# Altium schematic sheet MiniPCIe.SchDoc: POLYSOME CRYPTO 01
size A4; Revision: V1; SheetNumber: 7; SheetTotal: 8; ProjectName: POLYSOME CRYPTO 01
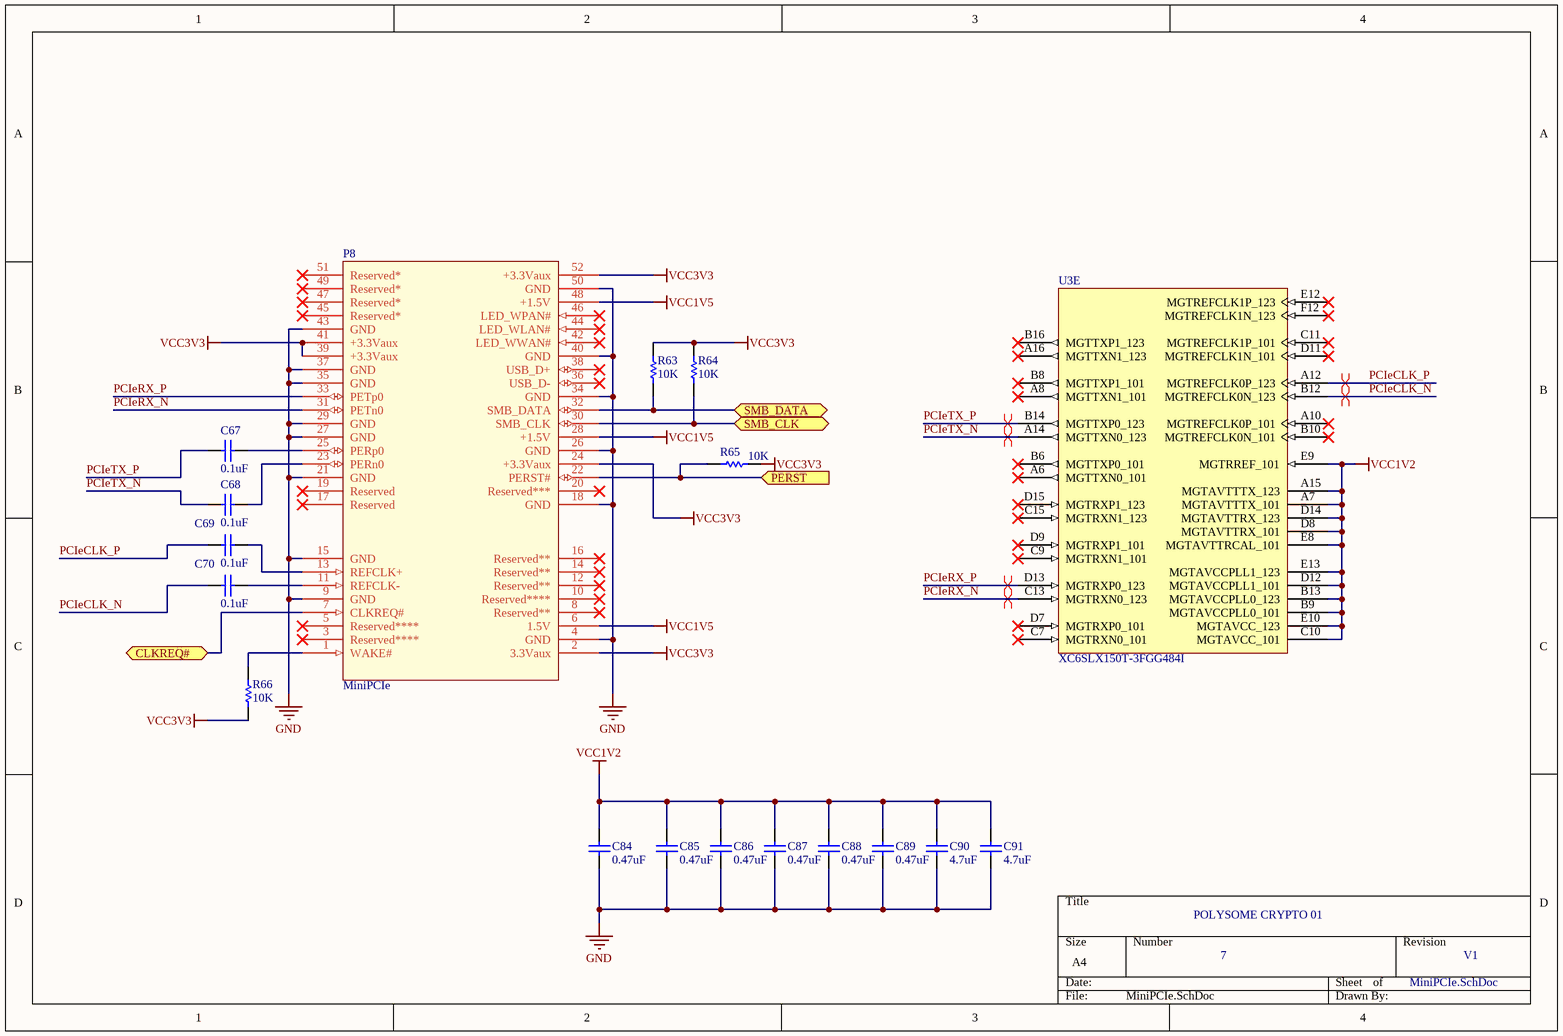
[diagram p0: MiniPCIe.SchDoc]

## Parts
C67  value 0.1uF  [0402]  (hidden comment: Cap Semi)
C68  value 0.1uF  [0402]  (hidden comment: Cap Semi)
C69  value 0.1uF  [0402]  (hidden comment: Cap Semi)
C70  value 0.1uF  [0402]  (hidden comment: Cap Semi)
C84  value 0.47uF  [0402]  (hidden comment: Cap Semi)
C85  value 0.47uF  [0402]  (hidden comment: Cap Semi)
C86  value 0.47uF  [0402]  (hidden comment: Cap Semi)
C87  value 0.47uF  [0402]  (hidden comment: Cap Semi)
C88  value 0.47uF  [0402]  (hidden comment: Cap Semi)
C89  value 0.47uF  [0402]  (hidden comment: Cap Semi)
C90  value 4.7uF  [0402]  (hidden comment: Cap Semi)
C91  value 4.7uF  [0402]  (hidden comment: Cap Semi)
P8  MiniPCIe  [Mini PCI Express]
R63  value 10K  [0402]  (hidden comment: Res Semi)
R64  value 10K  [0402]  (hidden comment: Res Semi)
R65  value 10K  [0402]  (hidden comment: Res Semi)
R66  value 10K  [0402]  (hidden comment: Res Semi)
U3  XC6SLX150T-3FGG484I  [FGG484]  (part E of 8)

## Ports
CLKREQ#, PERST (in), SMB_CLK (bidir), SMB_DATA (bidir)

## Nets
GND: C84.2 C85.2 C86.2 C87.2 C88.2 C89.2 C90.2 C91.2 P8.4(GND) P8.9(GND) P8.15(GND) P8.18(GND) P8.21(GND) P8.26(GND) P8.27(GND) P8.29(GND) P8.34(GND) P8.35(GND) P8.37(GND) P8.40(GND) P8.43(GND) P8.50(GND)
VCC1V2: C84.1 C85.1 C86.1 C87.1 C88.1 C89.1 C90.1 C91.1 U3.A7(MGTAVTTTX_101) U3.A15(MGTAVTTTX_123) U3.B9(MGTAVCCPLL0_101) U3.B13(MGTAVCCPLL0_123) U3.C10(MGTAVCC_101) U3.D8(MGTAVTTRX_101) U3.D12(MGTAVCCPLL1_101) U3.D14(MGTAVTTRX_123) U3.E8(MGTAVTTRCAL_101) U3.E9(MGTRREF_101) U3.E10(MGTAVCC_123) U3.E13(MGTAVCCPLL1_123)
VCC1V5: P8.6(1.5V) P8.28(+1.5V) P8.48(+1.5V)
VCC3V3: P8.2(3.3Vaux) P8.24(+3.3Vaux) P8.39(+3.3Vaux) P8.41(+3.3Vaux) P8.52(+3.3Vaux) R63.2 R64.2 R65.2 R66.1
CLKREQ#: P8.7(CLKREQ#) ; port CLKREQ#
PCIeCLK_N: C70.2 U3.B12(MGTREFCLK0N_123)
PCIeCLK_P: C69.2 U3.A12(MGTREFCLK0P_123)
PCIeRX_N: P8.31(PETn0) U3.C13(MGTRXN0_123)
PCIeRX_P: P8.33(PETp0) U3.D13(MGTRXP0_123)
PCIeTX_N: C68.2 U3.A14(MGTTXN0_123)
PCIeTX_P: C67.2 U3.B14(MGTTXP0_123)
PERST: P8.22(PERST#) R65.1 ; port PERST
SMB_CLK: P8.30(SMB_CLK) R64.1 ; port SMB_CLK
SMB_DATA: P8.32(SMB_DATA) R63.1 ; port SMB_DATA
NetC67_1: C67.1 P8.25(PERp0)
NetC68_1: C68.1 P8.23(PERn0)
NetC69_1: C69.1 P8.13(REFCLK+)
NetC70_1: C70.1 P8.11(REFCLK-)
NetP8_1: P8.1(WAKE#) R66.2

Not connected (* = marked no-connect by the designer): P8 3(Reserved****)* 5(Reserved****)* 8(Reserved**)* 10(Reserved****)* 12(Reserved**)* 14(Reserved**)* 16(Reserved**)* 17(Reserved)* 19(Reserved)* 20(Reserved***)* 36(USB_D-)* 38(USB_D+)* 42(LED_WWAN#)* 44(LED_WLAN#)* 45(Reserved*)* 46(LED_WPAN#)* 47(Reserved*)* 49(Reserved*)* 51(Reserved*)*; U3 A6(MGTTXN0_101)* A8(MGTTXN1_101)* A10(MGTREFCLK0P_101)* A16(MGTTXN1_123)* B6(MGTTXP0_101)* B8(MGTTXP1_101)* B10(MGTREFCLK0N_101)* B16(MGTTXP1_123)* C7(MGTRXN0_101)* C9(MGTRXN1_101)* C11(MGTREFCLK1P_101)* C15(MGTRXN1_123)* D7(MGTRXP0_101)* D9(MGTRXP1_101)* D11(MGTREFCLK1N_101)* D15(MGTRXP1_123)* E12(MGTREFCLK1P_123)* F12(MGTREFCLK1N_123)*

## Layout directives
differential pair; net class PCIE: PCIeCLK_N, PCIeCLK_P, PCIeRX_N, PCIeRX_P, PCIeTX_N, PCIeTX_P

## Library data of the parts
C67-C70 C84-C91 = Cap Semi: Capacitor (Semiconductor SIM Model); Published: 8-Jun-2000; LatestRevisionDate: 29-May-2009; LatestRevisionNote: IPC-7351 Footprint Added.; PackageReference: C1206; Publisher: Altium Limited; PackageDescription: Chip Capacitor
R63-R66 = Res Semi: Semiconductor Resistor; Published: 8-Jun-2000; LatestRevisionDate: 17-Jul-2002; LatestRevisionNote: Re-released for DXP Platform.; PackageReference: AXIAL-0.5; Publisher: Altium Limited; PackageDescription: Axial Device, Thru-Hole; 2 Leads; 0.5 in Pin Spacing
U3 = XC6SLX150T-3FGG484I: Spartan-6 LXT 1.2V FPGA, 296 User I/Os, 484-Ball Fine-Pitch BGA (1.0mm Pitch), Speed Grade 3, Industrial Grade, Pb-Free; Published: 17-Nov-2009; DatasheetVersion: ver1.6, Nov-2010; PackageVersion: ver1.1, Dec-2008; PackageReference: FGG484; Publisher: Altium Limited; PackageDescription: 484-Ball Fine Pitch Ball Grid Array 1.00 mm Pitch (FGG484) - Pb-Free; Supplier 1: Digi-Key; Supplier Part Number 1: XC6SLX150T-3FGG484I-ND; Code_JEDEC: MS-034-AAJ-1; Code_IPC: BGA100P22X22-484; ComponentLink1Description: Manufacturer Link; ComponentLink1URL: http://www.xilinx.com; ComponentLink2Description: Spartan-6 Datasheet; ComponentLink2URL: http://www.xilinx.com/support/documentation/data_sheets/ds160.pdf; ComponentLink3Description: Spartan-6 Documents; ComponentLink3URL: http://www.xilinx.com/support/documentation/spartan-6.htm; ComponentLink4Description: Xilinx.com Home; ComponentLink4URL: http://www.xilinx.com